# Altium project PSoC Motor Board.PrjPcb
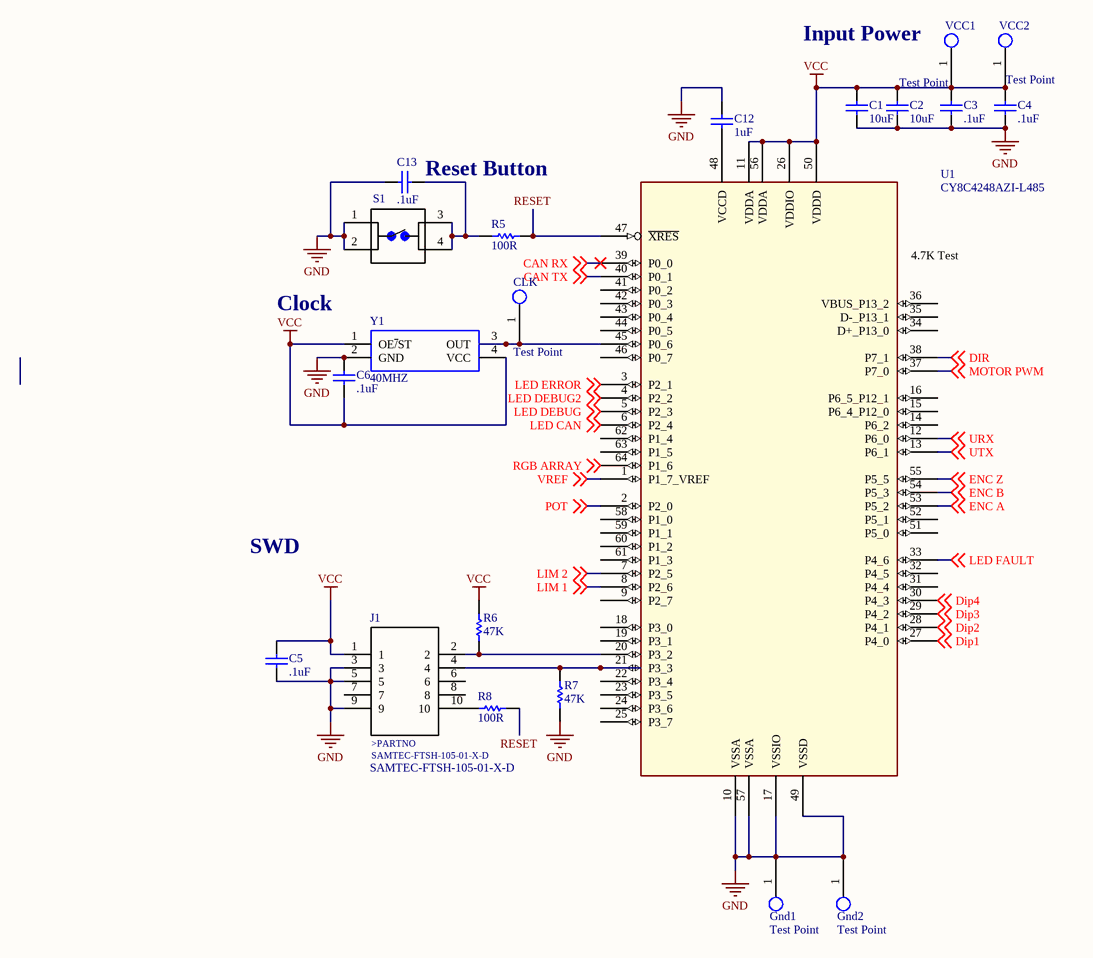
[diagram p0: PSoC Connections.SchDoc]
6 sheets, 85 parts. Net scope: global (net labels, ports and power ports of the same name join across sheets).
Board file: Motor Unit Rev 3.PcbDoc
Sheets:
  PSoC Connections.SchDoc
  DIP Switch.SchDoc
  Standard Header.SchDoc
  LEDs.SchDoc
  Motor Controller.SchDoc
  CAN.SchDoc

## Sheet PSoC Connections.SchDoc
size Letter

### Parts
C1  10uF  [CAPC0805(2012)130_N]
C2  10uF  [CAPC0805(2012)130_N]
C3  .1uF  [CAPC0805(2012)130_N]
C4  .1uF  [CAPC0805(2012)130_N]
C5  .1uF  [CAPC0805(2012)130_N]
C6  .1uF  [CAPC0805(2012)130_N]
C12  1uF  [CAPC0805(2012)130_N]
C13  .1uF  [CAPC0805(2012)130_N]
CLK  Test Point  [Test Point Through-hole]
Gnd1  Test Point  [Test Point Through-hole]
Gnd2  Test Point  [Test Point Through-hole]
J1  SAMTEC-FTSH-105-01-X-D  [SAMTEC-FTSH-105-01-X-D]
R5  100R  [RESC0805(2012)_N]
R6  47K  [RESC0805(2012)_N]
R7  47K  [RESC0805(2012)_N]
R8  100R  [RESC0805(2012)_N]
S1  1825910-7  [Switch 6mm 24V (NO)]  (value not drawn)
U1  CY8C4248AZI-L485  [TQFP50P1200X1200X160-64N]
VCC1  Test Point  [Test Point Through-hole]
VCC2  Test Point  [Test Point Through-hole]
Y1  40MHZ  [SG-636]

### Nets
GND: C1.1 C2.1 C3.1 C4.1 C5.1 C6.2 C12.2 C13.2 Gnd1.1 Gnd2.1 J1.3 J1.5 J1.9 R7.1 S1.1 S1.2 U1.10(VSSA) U1.17(VSSIO) U1.49(VSSD) U1.57(VSSA) Y1.2(GND)
VCC: C1.2 C2.2 C3.2 C4.2 C5.2 C6.1 J1.1 R6.2 U1.11(VDDA) U1.26(VDDIO) U1.50(VDDD) U1.56(VDDA) VCC1.1 VCC2.1 Y1.1(OE~{/}ST) Y1.4(VCC)
CAN RX: U1.39(P0_0) ; off-sheet CAN RX
CAN TX: U1.40(P0_1) ; off-sheet CAN TX
Dip1: U1.27(P4_0) ; off-sheet Dip1
Dip2: U1.28(P4_1) ; off-sheet Dip2
Dip3: U1.29(P4_2) ; off-sheet Dip3
Dip4: U1.30(P4_3) ; off-sheet Dip4
DIR: U1.38(P7_1) ; off-sheet DIR
ENC A: U1.53(P5_2) ; off-sheet ENC A
ENC B: U1.54(P5_3) ; off-sheet ENC B
ENC Z: U1.55(P5_5) ; off-sheet ENC Z
LED CAN: U1.6(P2_4) ; off-sheet LED CAN
LED DEBUG: U1.5(P2_3) ; off-sheet LED DEBUG
LED DEBUG2: U1.4(P2_2) ; off-sheet LED DEBUG2
LED ERROR: U1.3(P2_1) ; off-sheet LED ERROR
LED FAULT: U1.33(P4_6) ; off-sheet LED FAULT
LIM 1: U1.8(P2_6) ; off-sheet LIM 1
LIM 2: U1.7(P2_5) ; off-sheet LIM 2
MOTOR PWM: U1.37(P7_0) ; off-sheet MOTOR PWM
POT: U1.2(P2_0) ; off-sheet POT
RESET: R5.2 R8.2 U1.47(~{XRES})
RGB ARRAY: U1.64(P1_6) ; off-sheet RGB ARRAY
URX: U1.12(P6_0) ; off-sheet URX
UTX: U1.13(P6_1) ; off-sheet UTX
VREF: U1.1(P1_7_VREF) ; off-sheet VREF
NetC12_1: C12.1 U1.48(VCCD)
NetC13_1: C13.1 R5.1 S1.3 S1.4
NetCLK_1: CLK.1 U1.45(P0_6) Y1.3(OUT)
NetJ1_2: J1.2 R6.1 U1.20(P3_2)
NetJ1_4: J1.4 R7.2 U1.21(P3_3)
NetJ1_10: J1.10 R8.1

Not connected (* = marked no-connect by the designer): J1 6 7 8; U1 9(P2_7) 14(P6_2) 15(P6_4_P12_0) 16(P6_5_P12_1) 18(P3_0) 19(P3_1) 22(P3_4) 23(P3_5) 24(P3_6) 25(P3_7) 31(P4_4) 32(P4_5) 34(D+_P13_0) 35(D-_P13_1) 36(VBUS_P13_2) 41(P0_2) 42(P0_3) 43(P0_4) 44(P0_5) 46(P0_7) 51(P5_0) 52(P5_1) 58(P1_0) 59(P1_1) 60(P1_2) 61(P1_3) 62(P1_4) 63(P1_5)

### Notes on the sheet
- (near VCC1) Input Power
- (near C13) Reset Button
- Clock
- (near U1) 4.7K Test
- SWD
- Title
- Size:
- Date:
- Letter
- Number:
- Time:
- Revision:
- Sheet
- of
- File:
- (in symbol SAMTEC-FTSH-105-01-X-D) >PARTNO

### Library data of the parts
C1-C6 C12 C13 = CMP-1036-02603-1: CAP 390pF 200V ±5% 0805 (2012 Metric) Thickness 1.3mm SMD; Case-Metric: 2012; Case-EIA: 0805; Tolerance: Â±5%; Max Thickness: 1.3 mm; Rated Voltage: 200 V; Technology: SMT; Value: 390pF
R5 R7 R8 = 120R 5% 0805: 120R 0.125W 5% 0805 (2012 Metric)  SMD; Case-Metric: 2012; Value: 120.00 Ohm; Case-EIA: 0805; Tolerance: 5 %; Technology: SMT; Power: 0.125 W
R6 = 120R 5% 0805: 4.7K; Tolerance: 5 %; Case-Metric: 2012; Value: 120.00 Ohm; Case-EIA: 0805; Power: 0.125 W; Technology: SMT
S1 = Switch 6mm 24V (NO): FSM4JAH=6MM TACT SWITCH, HIGH TEMP; MF: TE Connectivity; Contact_Current_Rating: 50 mA; Configuration_Pole-Throw: Single Pole - Single Throw; Package: None; Digi-Key_Part_Number: 450-1804-ND; Digi-Key_Purchase_URL: https://www.digikey.com/product-detail/en/te-connectivity-alcoswitch-switches/1825910-7/450-1804-ND/1731414?utm_source=snapeda&utm_medium=aggregator&utm_campaign=symbol; MP: 1825910-7; SnapEDA_Link: https://www.snapeda.com/parts/1825910-7/TE%20Connectivity%20ALCOSWITCH%20Switches/view-part/?ref=snap; EU_RoHS_Compliance: Compliant; TE_purchase_URL: https://www.te.com/usa-en/product-1825910-7.html?te_bu=Cor&te_type=disp&te_campaign=seda_glo_cor-seda-global-disp-prtnr-fy19-seda-model-bom-cta_sma-317_1&elqCampaignId=32493; Value: *
Y1 = SG-636: Standard Clock Oscillators 50MHz 3.3Volt 100ppm -20C +70C; Manufacturer_Name: Epson Timing; Manufacturer_Part_Number: SG-636PCW 50.0000MC3: ROHS; RS Part Number: *; RS Price/Stock: *; Arrow Part Number: SG-636PCW 50.0000MC3: ROHS; Arrow Price/Stock: *; Datasheet Link: http://www.mouser.com/ds/2/137/G-636PCE_en-1003252.pdf
U1 = CY8C4248AZI-L485: Part_Number: CY8C4248AZI-L485

## Sheet DIP Switch.SchDoc
size Letter
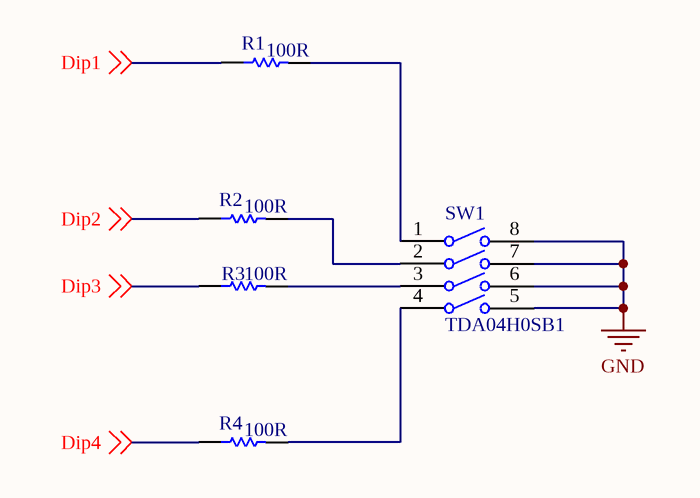
[diagram p1: DIP Switch.SchDoc]

### Parts
R1  100R  [RESC0805(2012)_N]
R2  100R  [RESC0805(2012)_N]
R3  100R  [RESC0805(2012)_N]
R4  100R  [RESC0805(2012)_N]
SW1  TDA04H0SB1  [CKCP-TDA04H0SB1R_V]

### Nets
GND: SW1.5 SW1.6 SW1.7 SW1.8
Dip1: R1.1 ; off-sheet Dip1
Dip2: R2.1 ; off-sheet Dip2
Dip3: R3.1 ; off-sheet Dip3
Dip4: R4.1 ; off-sheet Dip4
NetR1_2: R1.2 SW1.1
NetR2_2: R2.2 SW1.2
NetR3_2: R3.2 SW1.3
NetR4_2: R4.2 SW1.4

### Notes on the sheet
- Title
- Size:
- Date:
- Letter
- Number:
- Time:
- Revision:
- Sheet
- of
- File:

### Library data of the parts
R1-R4 = 120R 5% 0805: as R5 on sheet PSoC Connections; Tolerance: 5 %; Technology: SMT; Power: 0.125 W
SW1 = SMD Half-Pitch Dip Switch Array: Ultra-Miniature Surface Mount Half-Pitch DIP Switch, 25 mA, 24 V, -40 to 85 degC, 8-Pin SMD, RoHS, Tube; Contact Current Rating: 100 mA; Throw Configuration: SPST; Voltage Rating (DC): 24 V; Max Contact Resistance: 100 mohm; Max Current Rating: 25 mA; REACH SVHC: No SVHC; DatasheetVersion: 02/2016; Case\Package: DIP; Package Quantity: 70; Lead Pitch: 1.27 mm; Contact Plating: Gold; Packaging: Rail/Tube; Contact Finish: Gold; Mount: Surface Mount; Height: 2.3 mm; Contact Material: Copper; Max Operating Temperature: 85 degC; Max Voltage Rating (DC): 24 V; ComponentLink1URL: http://www.ck-components.com/media/1328/tda.pdf; PackageDescription: 8-Pin Surface Mount Device, Body 6.21 x 6.2 mm, Pitch 1.27 mm; Radiation Hardening: No; ComponentLink1Description: Datasheet; Current Rating: 100 mA; RoHSCompliant: true; PackageReference: TDA04H0SB1R; Min Operating Temperature: -40 degC; Pins: 4; Mounting Technology: Surface Mount; Length: 6.21 mm

## Sheet Standard Header.SchDoc
size Letter
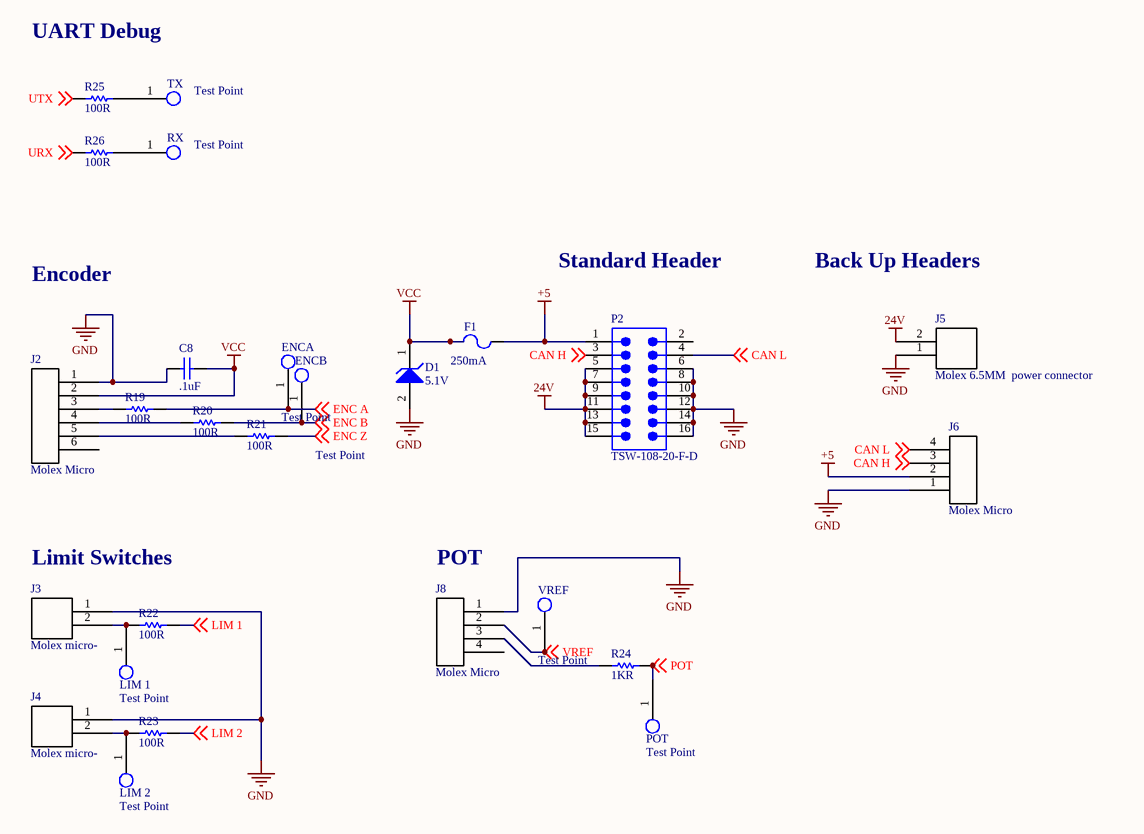
[diagram p2: Standard Header.SchDoc]

### Parts
C8  .1uF  [CAPC0805(2012)130_N]
D1  5.1V  [ONSC-SMB-2-403A-03_H_V]
ENCA  Test Point  [Test Point Through-hole]
ENCB  Test Point  [Test Point Through-hole]
F1  250mA  [BOUR-MF-NSMF150-2_V]
J2  Molex Micro  [0430450627]
J3  Molex micro-  [0430450227]
J4  Molex micro-  [0430450227]
J5  Molex 6.5MM  power connector  [1510482204]
J6  Molex Micro  [0430450427]
J8  Molex Micro  [0430450427]
LIM_1  Test Point  [Test Point Through-hole]
LIM_2  Test Point  [Test Point Through-hole]
P2  TSW-108-20-F-D  [SMTC-TSW-108-20-X-D]
POT  Test Point  [Test Point Through-hole]
R19  100R  [RESC0805(2012)_N]
R20  100R  [RESC0805(2012)_N]
R21  100R  [RESC0805(2012)_N]
R22  100R  [RESC0805(2012)_N]
R23  100R  [RESC0805(2012)_N]
R24  1KR  [RESC0805(2012)_N]
R25  100R  [RESC0805(2012)_N]
R26  100R  [RESC0805(2012)_N]
RX  Test Point  [Test Point Through-hole]
TX  Test Point  [Test Point Through-hole]
VREF  Test Point  [Test Point Through-hole]

### Nets
24V: J5.2 P2.5 P2.7 P2.9 P2.11 P2.13 P2.15
+5: F1.2 J6.2 P2.1
GND: C8.2 D1.2(A) J2.1 J3.1 J4.1 J5.1 J6.1 J8.1 P2.6 P2.8 P2.10 P2.12 P2.14 P2.16
VCC: C8.1 D1.1(K) F1.1 J2.2
CAN H: J6.3 P2.3 ; off-sheet CAN H
CAN L: J6.4 P2.4 ; off-sheet CAN L
ENC A: ENCA.1 R19.2 ; off-sheet ENC A
ENC B: ENCB.1 R20.2 ; off-sheet ENC B
ENC Z: R21.2 ; off-sheet ENC Z
LIM 1: R22.2 ; off-sheet LIM 1
LIM 2: R23.2 ; off-sheet LIM 2
POT: POT.1 R24.2 ; off-sheet POT
URX: R26.1 ; off-sheet URX
UTX: R25.1 ; off-sheet UTX
VREF: J8.2 VREF.1 ; off-sheet VREF
NetJ2_3: J2.3 R19.1
NetJ2_4: J2.4 R20.1
NetJ2_5: J2.5 R21.1
NetJ3_2: J3.2 LIM_1.1 R22.1
NetJ4_2: J4.2 LIM_2.1 R23.1
NetJ8_3: J8.3 R24.1
NetR25_2: R25.2 TX.1
NetR26_2: R26.2 RX.1

Not connected (* = marked no-connect by the designer): J2 6; J8 4; P2 2

### Notes on the sheet
- UART Debug
- Encoder
- Standard Header
- Back Up Headers
- Limit Switches
- (near J8) POT
- Title
- Size:
- Date:
- Letter
- Number:
- Time:
- Revision:
- Sheet
- of
- File:

### Library data of the parts
C8 = CMP-1036-02603-1: as C1 on sheet PSoC Connections; Max Thickness: 1.3 mm; Rated Voltage: 200 V; Technology: SMT; Value: 390pF
D1 = CMP-1060-00195-1: 3 W Zener Voltage Regulator, 2-Pin SMB, Pb-Free, Tape and Reel; PartNumber: 1SMB5917BT3G; Manufacturer: On Semiconductor; VZ Typ (V): 4.7; RoHS: Pb-Free; ComponentLink1Description: Manufacturer URL; ComponentLink2URL: http://www.onsemi.com/pub_link/Collateral/1SMB5913BT3-D.PDF; Mounting Technology: Surface Mount; PackageVersion: Rev. H, 05/2011; DatasheetVersion: Rev. 8; Packing: Tape and Reel; ComponentLink2Description: Datasheet; ComponentLink3Description: Package Specification; PackageReference: SMB-2-403A-03_H; ComponentLink1URL: http://www.onsemi.com/; PackageDescription: 2-Pin Small Molded Package, J-Bend Lead, Body 4.33 x 3.625 mm; ComponentLink3URL: http://www.onsemi.com/pub_link/Collateral/1SMB5913BT3-D.PDF
F1 = CMP-2000-06693-1: PTC Resettable Fuse, 6 V, 100 A, -40 to 85 degC, 2-Pin SMD, RoHS, Tape and Reel; Manufacturer: Bourns; Trip Current: 3A; Maximum Voltage DC: 6V; Current Rating: 100A; Resistance: 130mOhms; Type: PTCResettableFuses; Hold Current: 1.5A; Maximum Voltage: 6VDC; RoHS: Details; Current Rating (Max): 100A; Datasheet URL: http://www.bourns.com/docs/Product-Datasheets/mfnsmf.pdf; Package Description: 2-Pin Surface Mount Device, Body 3.2 x 1.6 mm; Series: MF-NSMF; Mounting Technology: SurfaceMount; Dimensions: 3.4mmLx1.8mmWx0.7mmH; Termination Style: SMD/SMT; Datasheet Version: Rev. T, 08/2015; Package / Case: 1206(3216metric); Manufacturer URL: http://www.bourns.com/; Product Category: ResettableFuses-PPTC; Packaging: Reel; Brand: Bourns; Mounting Style: SMD/SMT; Package Reference: MF-NSMF150-2; Current Rating - Max: 100A; Tradename: Multifuse; Factory Pack Quantity: 3000; Operating Temperature Range: -40Cto+85C
J2 = Molex micro-fit 6-pin (single row schematic): Molex micro-fit 3.0 dual row connector. P/N 0430450627
J3 J4 = Molex micro-fit 2-pin: Molex micro-fit 3.0. Molex P/N 0430450227
J6 J8 = Molex micro-fit 4-pin (Single row schematic): Molex micro-fit 3.0 dual row header. P/N 0430450427
P2 = CMP-1024-00413-1: Manufacturer: Samtec; Pitch: 2.54 mm; ComponentLink1Description: Manufacturer URL; ComponentLink1URL: http://www.samtec.com; Mounting Technology: Through-hole; PackageReference: TSW-108-20-X-D; ComponentLink3URL: http://www.samtec.com/documents/webfiles/cpdf/TSW-XXX-XX-XXX-X-XX-XXX-MKT.pdf; PackageDescription: .025[0.64] SQ. Post Terminal Strip Assembly; RoHS: True; ComponentLink2URL: http://www.samtec.com/documents/webfiles/pdf/TSW_TH.PDF; PackageVersion: DM, 8/1988; ComponentLink3Description: Package Specification; PartNumber: TSW-108-20-F-D; Temperature Range: -55 to 125 degC; DatasheetVersion: F-214; ComponentLink2Description: Datasheet; Orientation: Vertical
R19-R23 R25 R26 = 120R 5% 0805: as R5 on sheet PSoC Connections; Tolerance: 5 %; Technology: SMT; Power: 0.125 W
R24 = 120R 5% 0805: Tolerance: 5 %; Case-Metric: 2012; Value: 120.00 Ohm; Case-EIA: 0805; Power: 0.125 W; Technology: SMT

## Sheet LEDs.SchDoc
size A
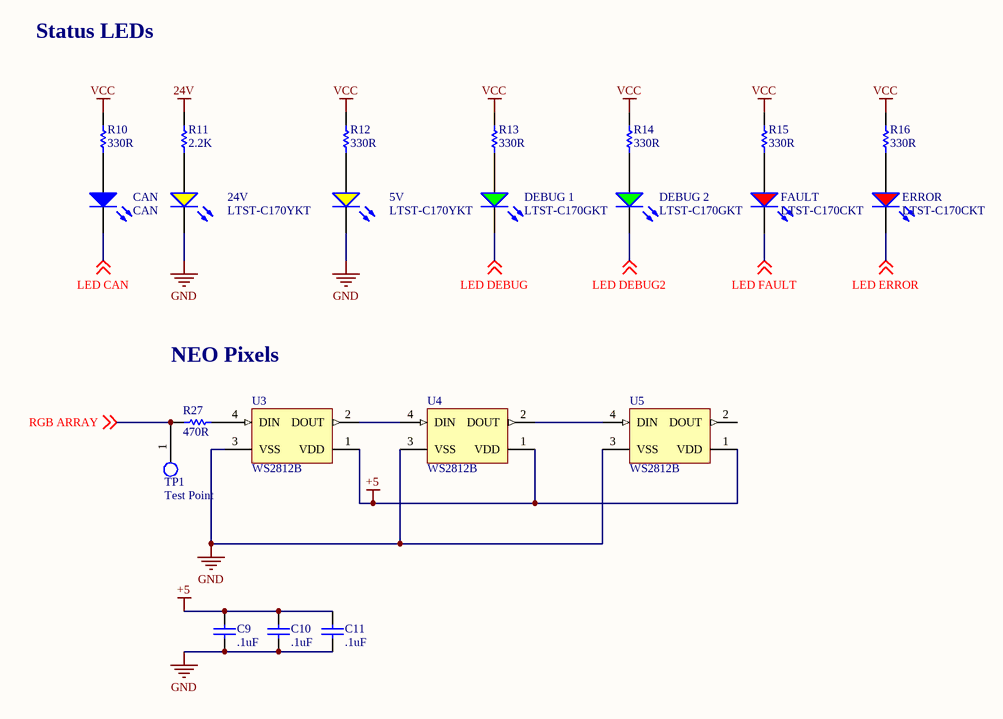
[diagram p3: LEDs.SchDoc]

### Parts
5V  LTST-C170YKT  [LTST-C170YKT_V]
24V  LTST-C170YKT  [LTST-C170YKT_V]
C9  .1uF  [CAPC0805(2012)130_N]
C10  .1uF  [CAPC0805(2012)130_N]
C11  .1uF  [CAPC0805(2012)130_N]
CAN  CAN  [0805_A]
DEBUG_1  LTST-C170GKT  [LTST-C170GKT_V]
DEBUG_2  LTST-C170GKT  [LTST-C170GKT_V]
ERROR  LTST-C170CKT  [LTST-C170CKT_V]
FAULT  LTST-C170CKT  [LTST-C170CKT_V]
R10  330R  [RESC0805(2012)_N]
R11  2.2K  [RESC0805(2012)_N]
R12  330R  [RESC0805(2012)_N]
R13  330R  [RESC0805(2012)_N]
R14  330R  [RESC0805(2012)_N]
R15  330R  [RESC0805(2012)_N]
R16  330R  [RESC0805(2012)_N]
R27  470R  [RESC0805(2012)_N]
TP1  Test Point  [Test Point Through-hole]
U3  WS2812B  [ADAI-WS2812B_V]
U4  WS2812B  [ADAI-WS2812B_V]
U5  WS2812B  [ADAI-WS2812B_V]

### Nets
24V: R11.2
+5: C9.2 C10.2 C11.2 U3.1(VDD) U4.1(VDD) U5.1(VDD)
GND: 5V.2(K) 24V.2(K) C9.1 C10.1 C11.1 U3.3(VSS) U4.3(VSS) U5.3(VSS)
VCC: R10.2 R12.2 R13.2 R14.2 R15.2 R16.2
LED CAN: CAN.1(K) ; off-sheet LED CAN
LED DEBUG: DEBUG_1.2(K) ; off-sheet LED DEBUG
LED DEBUG2: DEBUG_2.2(K) ; off-sheet LED DEBUG2
LED ERROR: ERROR.2(K) ; off-sheet LED ERROR
LED FAULT: FAULT.2(K) ; off-sheet LED FAULT
RGB ARRAY: R27.1 TP1.1 ; off-sheet RGB ARRAY
Net5V_1: 5V.1(A) R12.1
Net24V_1: 24V.1(A) R11.1
NetCAN_2: CAN.2(A) R10.1
NetDEBUG_1_1: DEBUG_1.1(A) R13.1
NetDEBUG_2_1: DEBUG_2.1(A) R14.1
NetERROR_1: ERROR.1(A) R16.1
NetFAULT_1: FAULT.1(A) R15.1
NetR27_2: R27.2 U3.4(DIN)
NetU3_2: U3.2(DOUT) U4.4(DIN)
NetU4_2: U4.2(DOUT) U5.4(DIN)

Not connected (* = marked no-connect by the designer): U5 2(DOUT)

### Notes on the sheet
- Status LEDs
- NEO Pixels

### Library data of the parts
5V 24V = CMP-1674-00003-5: LED Uni-Color Yellow, 60 mW, 80 mA, -55 to 85 degC, 2-Pin SMD, RoHS, Tape and Reel; Manufacturer: Lite-On; PackageReference: C170YKT; ComponentLink1Description: Manufacturer URL; ComponentLink1URL: http://www.us.liteon.com/; Mounting Technology: Surface Mount; Height: 1.1 mm; Mount: Surface Mount; Packaging: Tape and Reel; Length: 2 mm; RoHSCompliant: true; Colour: Yellow; Max Operating Temperature: 85 degC; Min Operating Temperature: -55 degC; DatasheetVersion: 03/2000; PackageDescription: 2-Pin Surface Mount Device, Body 2 x 1.25 mm; ComponentLink2URL: http://media.digikey.com/pdf/Data Sheets/Lite-On PDFs/LTST-C170YKT.pdf; Package Quantity: 3000; ComponentLink2Description: Datasheet; Pins: 2
C9-C11 = CMP-1036-02603-1: as C1 on sheet PSoC Connections; Max Thickness: 1.3 mm; Rated Voltage: 200 V; Technology: SMT; Value: 390pF
CAN = CMP-1426-00008-1: SMD mono-color Chip LED, WL-SMCW, Blue; Manufacturer: Wuerth Elektronik; PartNumber: 150080BS75000; Color: Blue; ComponentLink2URL: http://katalog.we-online.com/led/datasheet/150080BS75000.pdf; ComponentLink1URL: http://www.we-online.com; ComponentLink2Description: Datasheet; PackageReference: 0805_A; ComponentLink1Description: Manufacturer URL
DEBUG_1 DEBUG_2 = CMP-1674-00002-5: LED Uni-Color Green, 100 mW, 120 mA, -55 to 85 degC, 2-Pin SMD, RoHS, Tape and Reel; Manufacturer: Lite-On; PackageReference: C170GKT; ComponentLink1Description: Manufacturer URL; ComponentLink1URL: http://www.us.liteon.com/; Height: 1.1 mm; PackageDescription: 2-Pin Surface Mount Device, Body 2 x 1.25 mm; RoHSCompliant: true; Package Quantity: 1; Packaging: Tape and Reel; Mount: Surface Mount; Min Operating Temperature: -55 degC; DatasheetVersion: 03/2003; Max Operating Temperature: 85 degC; Pins: 2; Mounting Technology: Surface Mount; Length: 2 mm; Colour: Green; ComponentLink2URL: http://media.digikey.com/pdf/Data%20Sheets/Lite-On%20PDFs/LTST-C170GKT.pdf; ComponentLink2Description: Datasheet
ERROR FAULT = CMP-1674-00001-5: LED Uni-Color Red, 100 mW, 200 mA, -55 to 85 degC, 2-Pin SMD, RoHS, Tape and Reel; Manufacturer: Lite-On; ComponentLink1Description: Manufacturer URL; PackageReference: C170CKT; ComponentLink1URL: http://www.us.liteon.com/; Package Quantity: 3000; Packaging: Tape and Reel; Pins: 2; ComponentLink2URL: http://media.digikey.com/pdf/Data%20Sheets/Lite-On%20PDFs/LTST-C170CKT.pdf; Max Operating Temperature: 85 degC; Min Operating Temperature: -55 degC; Mounting Technology: Surface Mount; Mount: Surface Mount; Length: 2 mm; ComponentLink2Description: Datasheet; DatasheetVersion: 03/2003; Height: 1.1 mm; PackageDescription: 2-Pin Surface Mount Device, Body 2 x 1.25 mm; RoHSCompliant: true; Colour: Red
R10-R16 R27 = 120R 5% 0805: as R5 on sheet PSoC Connections; Tolerance: 5 %; Technology: SMT; Power: 0.125 W
U3-U5 = CMP-1740-00005-1: Intelligent Control LED Integrated Light Source, 3.5 to 5.3 V, -25 to 80 degC, 4-Pin SMD, RoHS, Bulk; Case\Package: Radial; Shielding: Unshielded; Current Rating: 240 mA; Tolerance: 10%; Mount: Through Hole; Max Operating Temperature: 125 degC; Radiation Hardening: No; Length: 12.2 mm; Min Operating Temperature: -55 degC; ComponentLink1URL: https://www.adafruit.com/; Packaging: Bulk; Lead Pitch: 5 mm; RoHSCompliant: true; Pins: 2; Package Quantity: 200; ComponentLink2URL: https://cdn-shop.adafruit.com/datasheets/WS2812B.pdf; ComponentLink2Description: Datasheet; PackageDescription: 4-Pin Surface Mount Device, Body 5 x 5 mm, Pitch 3.3 mm; PackageReference: WS2812B; Height: 12.2 mm; REACH SVHC: No SVHC; ComponentLink1Description: Manufacturer URL; DatasheetVersion: May-13

## Sheet Motor Controller.SchDoc
size A
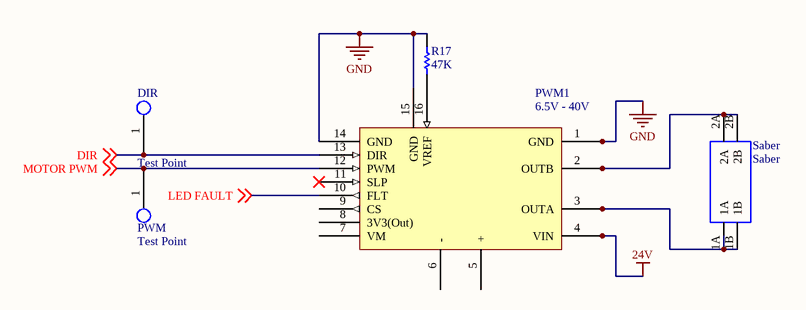
[diagram p4: Motor Controller.SchDoc]

### Parts
DIR  Test Point  [Test Point Through-hole]
PWM  Test Point  [Test Point Through-hole]
PWM1  6.5V - 40V  [Pololu_G2_Driver_24v21]
R17  47K  [RESC0805(2012)_N]
Saber  Saber  [Saber]

### Nets
24V: PWM1.4(VIN) PWM1.4a(VIN) PWM1.4b(VIN)
GND: PWM1.1(GND) PWM1.1a(GND) PWM1.1b(GND) PWM1.14(GND) PWM1.15(GND) R17.2
DIR: DIR.1 PWM1.13(DIR) ; off-sheet DIR
LED FAULT: PWM1.10(FLT) ; off-sheet LED FAULT
MOTOR PWM: PWM.1 PWM1.12(PWM) ; off-sheet MOTOR PWM
NetPWM1_2: PWM1.2(OUTB) PWM1.2a(OUTB) PWM1.2b(OUTB) Saber.2A Saber.2B
NetPWM1_3: PWM1.3(OUTA) PWM1.3a(OUTA) PWM1.3b(OUTA) Saber.1A Saber.1B
NetPWM1_16: PWM1.16(VREF) R17.1

Not connected (* = marked no-connect by the designer): PWM1 5(+) 6(-) 7(VM) 8(3V3(Out)) 9(CS) 11(SLP)*

### Library data of the parts
PWM1 = Pololu G2 High-Power Motor Driver 24v21: This discrete MOSFET H-bridge motor driver enables bidirectional control of one high-power DC brushed motor. The small 1.3″ × 0.8″ board supports a wide 6.5 V to 40 V voltage range and is efficient enough to deliver a continuous 21 A without a heat sink. Additional features of this second-generation (G2) driver include reverse-voltage protection along with basic current sensing and current limiting functionality.; ComponentLink1Description: Product Info; ComponentLink1URL: https://www.pololu.com/product/2995/specs
R17 = 120R 5% 0805: as R5 on sheet PSoC Connections; Tolerance: 5 %; Technology: SMT; Power: 0.125 W

## Sheet CAN.SchDoc
size A
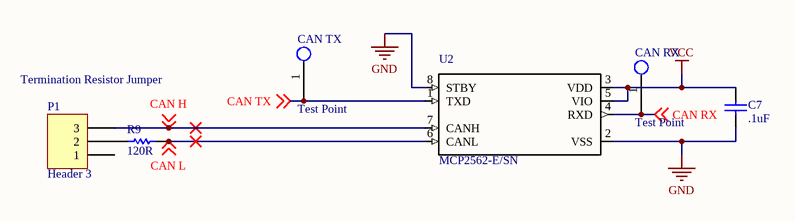
[diagram p5: CAN.SchDoc]

### Parts
C7  .1uF  [CAPC0805(2012)130_N]
CAN_RX  Test Point  [Test Point Through-hole]
CAN_TX  Test Point  [Test Point Through-hole]
P1  Header 3  [HDR1X3]
R9  120R  [RESC0805(2012)_N]
U2  MCP2562-E/SN  [SOIC127P600X175-8N]

### Nets
GND: C7.1 U2.2(VSS) U2.8(STBY)
VCC: C7.2 U2.3(VDD) U2.5(VIO)
CAN H: P1.3 U2.7(CANH) ; off-sheet CAN H
CAN L: R9.2 U2.6(CANL) ; off-sheet CAN L
CAN RX: CAN_RX.1 U2.4(RXD) ; off-sheet CAN RX
CAN TX: CAN_TX.1 U2.1(TXD) ; off-sheet CAN TX
NetP1_2: P1.2 R9.1

Not connected (* = marked no-connect by the designer): P1 1

### Notes on the sheet
- Termination Resistor Jumper

### Library data of the parts
C7 = CMP-1036-02603-1: as C1 on sheet PSoC Connections; Max Thickness: 1.3 mm; Rated Voltage: 200 V; Technology: SMT; Value: 390pF
P1 = Header 3: Header, 3-Pin; LatestRevisionDate: 17-Jul-2002; LatestRevisionNote: Re-released for DXP Platform.; Publisher: Altium Limited
R9 = 120R 5% 0805: as R5 on sheet PSoC Connections; Tolerance: 5 %; Technology: SMT; Power: 0.125 W
U2 = MCP2562-E/SN: Microchip MCP2562-E/SN, CAN Transceiver 1MBps 1-channel IEC 61000-4-2, 8-Pin SOIC; Price: None; MF: Microchip; SnapEDA_Link: https://www.snapeda.com/parts/MCP2562-E/SN/Microchip/view-part/?ref=snap; MP: MCP2562-E/SN; Availability: Unavailable; Package: SO-8 Microchip; Value: *

## Nets that join several sheets
24V: Standard Header (7 pins), LEDs (R11.2), Motor Controller (PWM1.4 PWM1.4a PWM1.4b)
+5: Standard Header (F1.2 J6.2 P2.1), LEDs (6 pins)
GND: PSoC Connections (21 pins), DIP Switch (SW1.5 SW1.6 SW1.7 SW1.8), Standard Header (14 pins), LEDs (8 pins), Motor Controller (6 pins), CAN (C7.1 U2.2 U2.8)
VCC: PSoC Connections (16 pins), Standard Header (C8.1 D1.1 F1.1 J2.2), LEDs (6 pins), CAN (C7.2 U2.3 U2.5)
CAN H: Standard Header (J6.3 P2.3), CAN (P1.3 U2.7)
CAN L: Standard Header (J6.4 P2.4), CAN (R9.2 U2.6)
CAN RX: PSoC Connections (U1.39), CAN (CAN_RX.1 U2.4)
CAN TX: PSoC Connections (U1.40), CAN (CAN_TX.1 U2.1)
Dip1: PSoC Connections (U1.27), DIP Switch (R1.1)
Dip2: PSoC Connections (U1.28), DIP Switch (R2.1)
Dip3: PSoC Connections (U1.29), DIP Switch (R3.1)
Dip4: PSoC Connections (U1.30), DIP Switch (R4.1)
DIR: PSoC Connections (U1.38), Motor Controller (DIR.1 PWM1.13)
ENC A: PSoC Connections (U1.53), Standard Header (ENCA.1 R19.2)
ENC B: PSoC Connections (U1.54), Standard Header (ENCB.1 R20.2)
ENC Z: PSoC Connections (U1.55), Standard Header (R21.2)
LED CAN: PSoC Connections (U1.6), LEDs (CAN.1)
LED DEBUG: PSoC Connections (U1.5), LEDs (DEBUG_1.2)
LED DEBUG2: PSoC Connections (U1.4), LEDs (DEBUG_2.2)
LED ERROR: PSoC Connections (U1.3), LEDs (ERROR.2)
LED FAULT: PSoC Connections (U1.33), LEDs (FAULT.2), Motor Controller (PWM1.10)
LIM 1: PSoC Connections (U1.8), Standard Header (R22.2)
LIM 2: PSoC Connections (U1.7), Standard Header (R23.2)
MOTOR PWM: PSoC Connections (U1.37), Motor Controller (PWM.1 PWM1.12)
POT: PSoC Connections (U1.2), Standard Header (POT.1 R24.2)
RGB ARRAY: PSoC Connections (U1.64), LEDs (R27.1 TP1.1)
URX: PSoC Connections (U1.12), Standard Header (R26.1)
UTX: PSoC Connections (U1.13), Standard Header (R25.1)
VREF: PSoC Connections (U1.1), Standard Header (J8.2 VREF.1)